# Altium schematic sheet coil_processing.SchDoc
size A
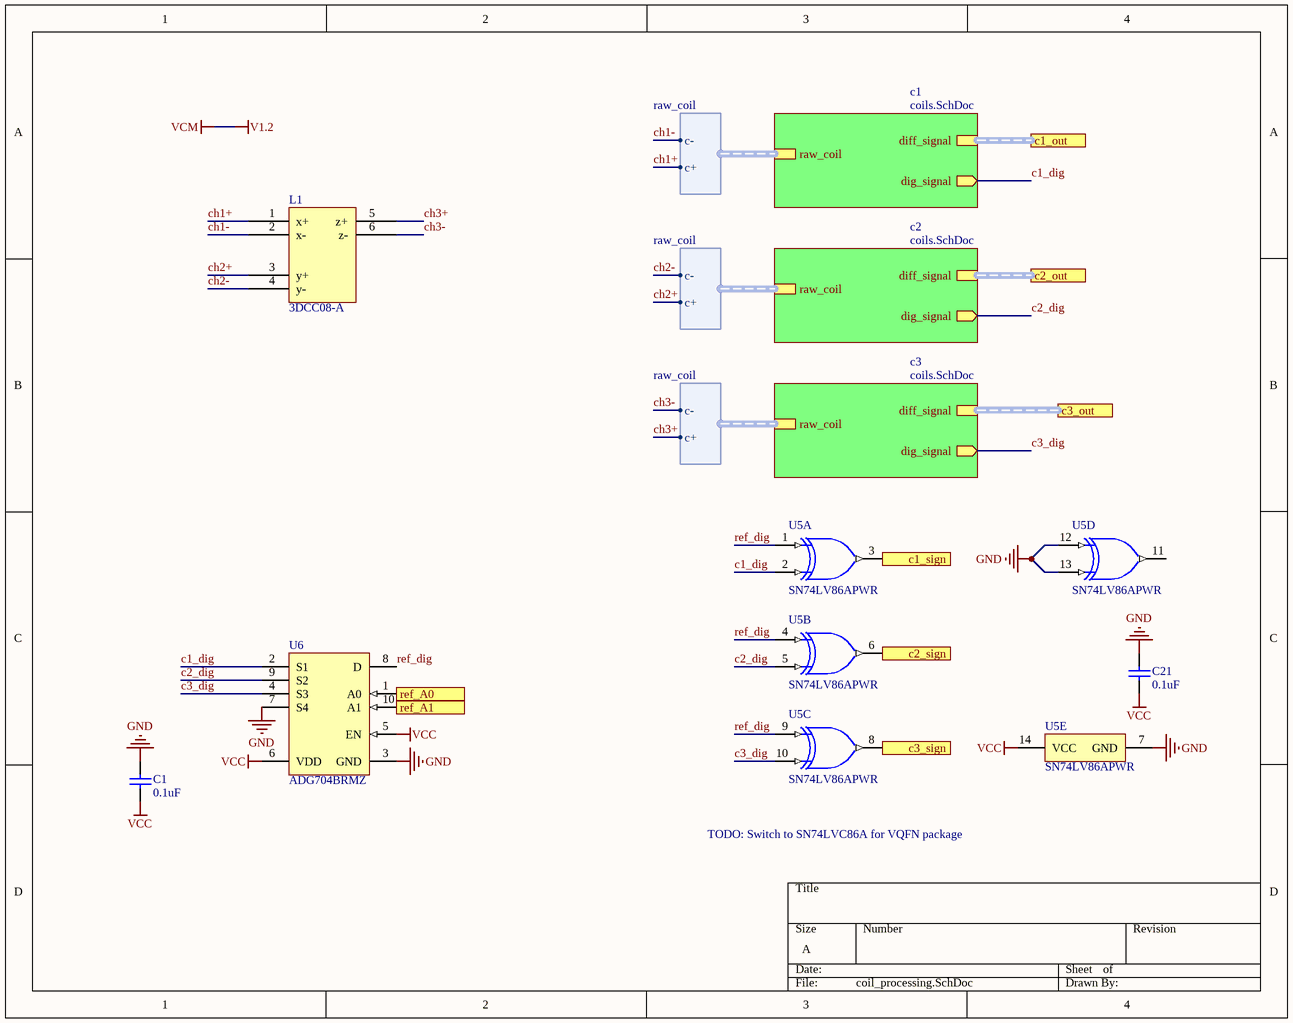
[diagram p0: coil_processing.SchDoc]

## Parts
C1  value 0.1uF  [0402]  (hidden comment: Cap)
C21  value 0.1uF  [0402]  (hidden comment: Cap)
L1  3DCC08-A  [3DCC08-A]
U5  SN74LV86APWR  [PW0014A_L]  (parts A,B,C,D,E of 5)
U6  ADG704BRMZ  [ADI-RM-10_N]

## Sub-sheets
c1 = coils.SchDoc: raw_coil (harness raw_coil), diff_signal (harness diff_signal), dig_signal (out)  | C1_val: 2200pF; C2_val: 100pF
c2 = coils.SchDoc: raw_coil (harness raw_coil), diff_signal (harness diff_signal), dig_signal (out)  | C1_val: 2200pF; C2_val: 100pF
c3 = coils.SchDoc: raw_coil (harness raw_coil), diff_signal (harness diff_signal), dig_signal (out)  | C1_val: 2200pF; C2_val: 100pF

## Ports
c1_out (harness diff_signal), c1_sign (out), c2_out (harness diff_signal), c2_sign (out), c3_out (harness diff_signal), c3_sign (out), ref_A0 (in), ref_A1 (in)

## Harnesses
raw_coil: c-, c+

## Nets
GND: C1.2 C21.2 U5.7(GND) U5.12(4A) U5.13(4B) U6.3(GND) U6.7(S4)
VCC: C1.1 C21.1 U5.14(VCC) U6.5(EN) U6.6(VDD)
c1_dig: U5.2(1B) U6.2(S1) ; sheet c1/dig_signal
c1_sign: U5.3(1Y) ; port c1_sign
c2_dig: U5.5(2B) U6.9(S2) ; sheet c2/dig_signal
c2_sign: U5.6(2Y) ; port c2_sign
c3_dig: U5.10(3B) U6.4(S3) ; sheet c3/dig_signal
c3_sign: U5.8(3Y) ; port c3_sign
ch1+: L1.1(x+) ; sheet c1/raw_coil.c+
ch1-: L1.2(x-) ; sheet c1/raw_coil.c-
ch2+: L1.3(y+) ; sheet c2/raw_coil.c+
ch2-: L1.4(y-) ; sheet c2/raw_coil.c-
ch3+: L1.5(z+) ; sheet c3/raw_coil.c+
ch3-: L1.6(z-) ; sheet c3/raw_coil.c-
ref_A0: U6.1(A0) ; port ref_A0
ref_A1: U6.10(A1) ; port ref_A1
ref_dig: U5.1(1A) U5.4(2A) U5.9(3A) U6.8(D)

Not connected (* = marked no-connect by the designer): U5 11(4Y)

## Buses and harness runs
harness port c1_out = sheet c1/diff_signal
harness port c2_out = sheet c2/diff_signal
harness port c3_out = sheet c3/diff_signal

## Notes on the sheet
- TODO: Switch to SN74LVC86A for VQFN package

## Library data of the parts
C1 C21 = Cap: Ceramic Capacitor (Surface Mount); Manufacturer: Generic Ceramic Chip Cap (TBD); Digi-Key Part Number: *; Manufacturer Part Number: *; Note: *; Rating: *
U5 = CMP-0778-00149-3: Quadruple 2-Input Exclusive-OR Gates, PW0014A, LARGE T&R; Manufacturer: Texas Instruments; Input Type: TTL; Schmitt Trigger: No; Bits(#): 4; Rating: Catalog; Voltage(Nom)(V): 2.5,3.3,5; Technology Family: LV-A; ICC @ Nom Voltage(Max)(mA): 0.02; Output Drive (IOL/IOH)(Max)(mA): 50/-50; F @ Nom Voltage(Max)(Mhz): 70; VCC(Max)(V): 5.5; tpd @ Nom Voltage(Max)(ns): 21,13,8; VCC(Min)(V): 2; Operating Temperature Range(C): -40 to 125,-40 to 85; Generic Part Number: SN74LV86A; PackageReference: PW0014A; Output Type: TTL; DatasheetVersion: SCLS392G
U6 = CMP-0798-00103-1: CMOS Low Voltage 4 Ohm, 4-Channel Multiplexer, -40 to 85 degC, 10-pin SOP (RM-10), Tube; Manufacturer: Analog Devices; Bandwidth (Hz): 200M; Supply V Guar Performance: Single_(+3.3V), Single_(+3V), Single_(+5V); Ron (ohms): 4; Max Analog Signal Range: 0 to Vdd; PackageDescription: 10-Pin Mini Small Outline Package, Body 3 x 3 mm, Pitch 0.5 mm; PackageVersion: Aug-05; Packing: Tube; PartNumber: ADG704BRMZ; ComponentLink3Description: Package Specification; ComponentLink3URL: http://www.analog.com/static/imported-files/packages/PKG_PDF/MSOP%28RM%29/RM_10.pdf; ComponentLink2Description: Datasheet; ComponentLink1URL: http://www.analog.com/en/index.html; ComponentLink1Description: Manufacturer URL; ComponentLink2URL: http://www.analog.com/static/imported-files/data_sheets/ADG704.pdf; Mounting Technology: Surface Mount; DatasheetVersion: Rev. A; Code_JEDEC: MO-187-BA; PackageReference: RM-10
L1 = 3DCC08-A: ComponentLink1Description: Premo; ComponentLink1URL: https://www.grupopremo.com/618-3dcc08-3d-coil-cube-receiver-sensor-for-vr-magnetic-tracking-system-165x148x118-mm-